# EAGLE schematic ServoIface_v1.0 (EAGLE 6.4)
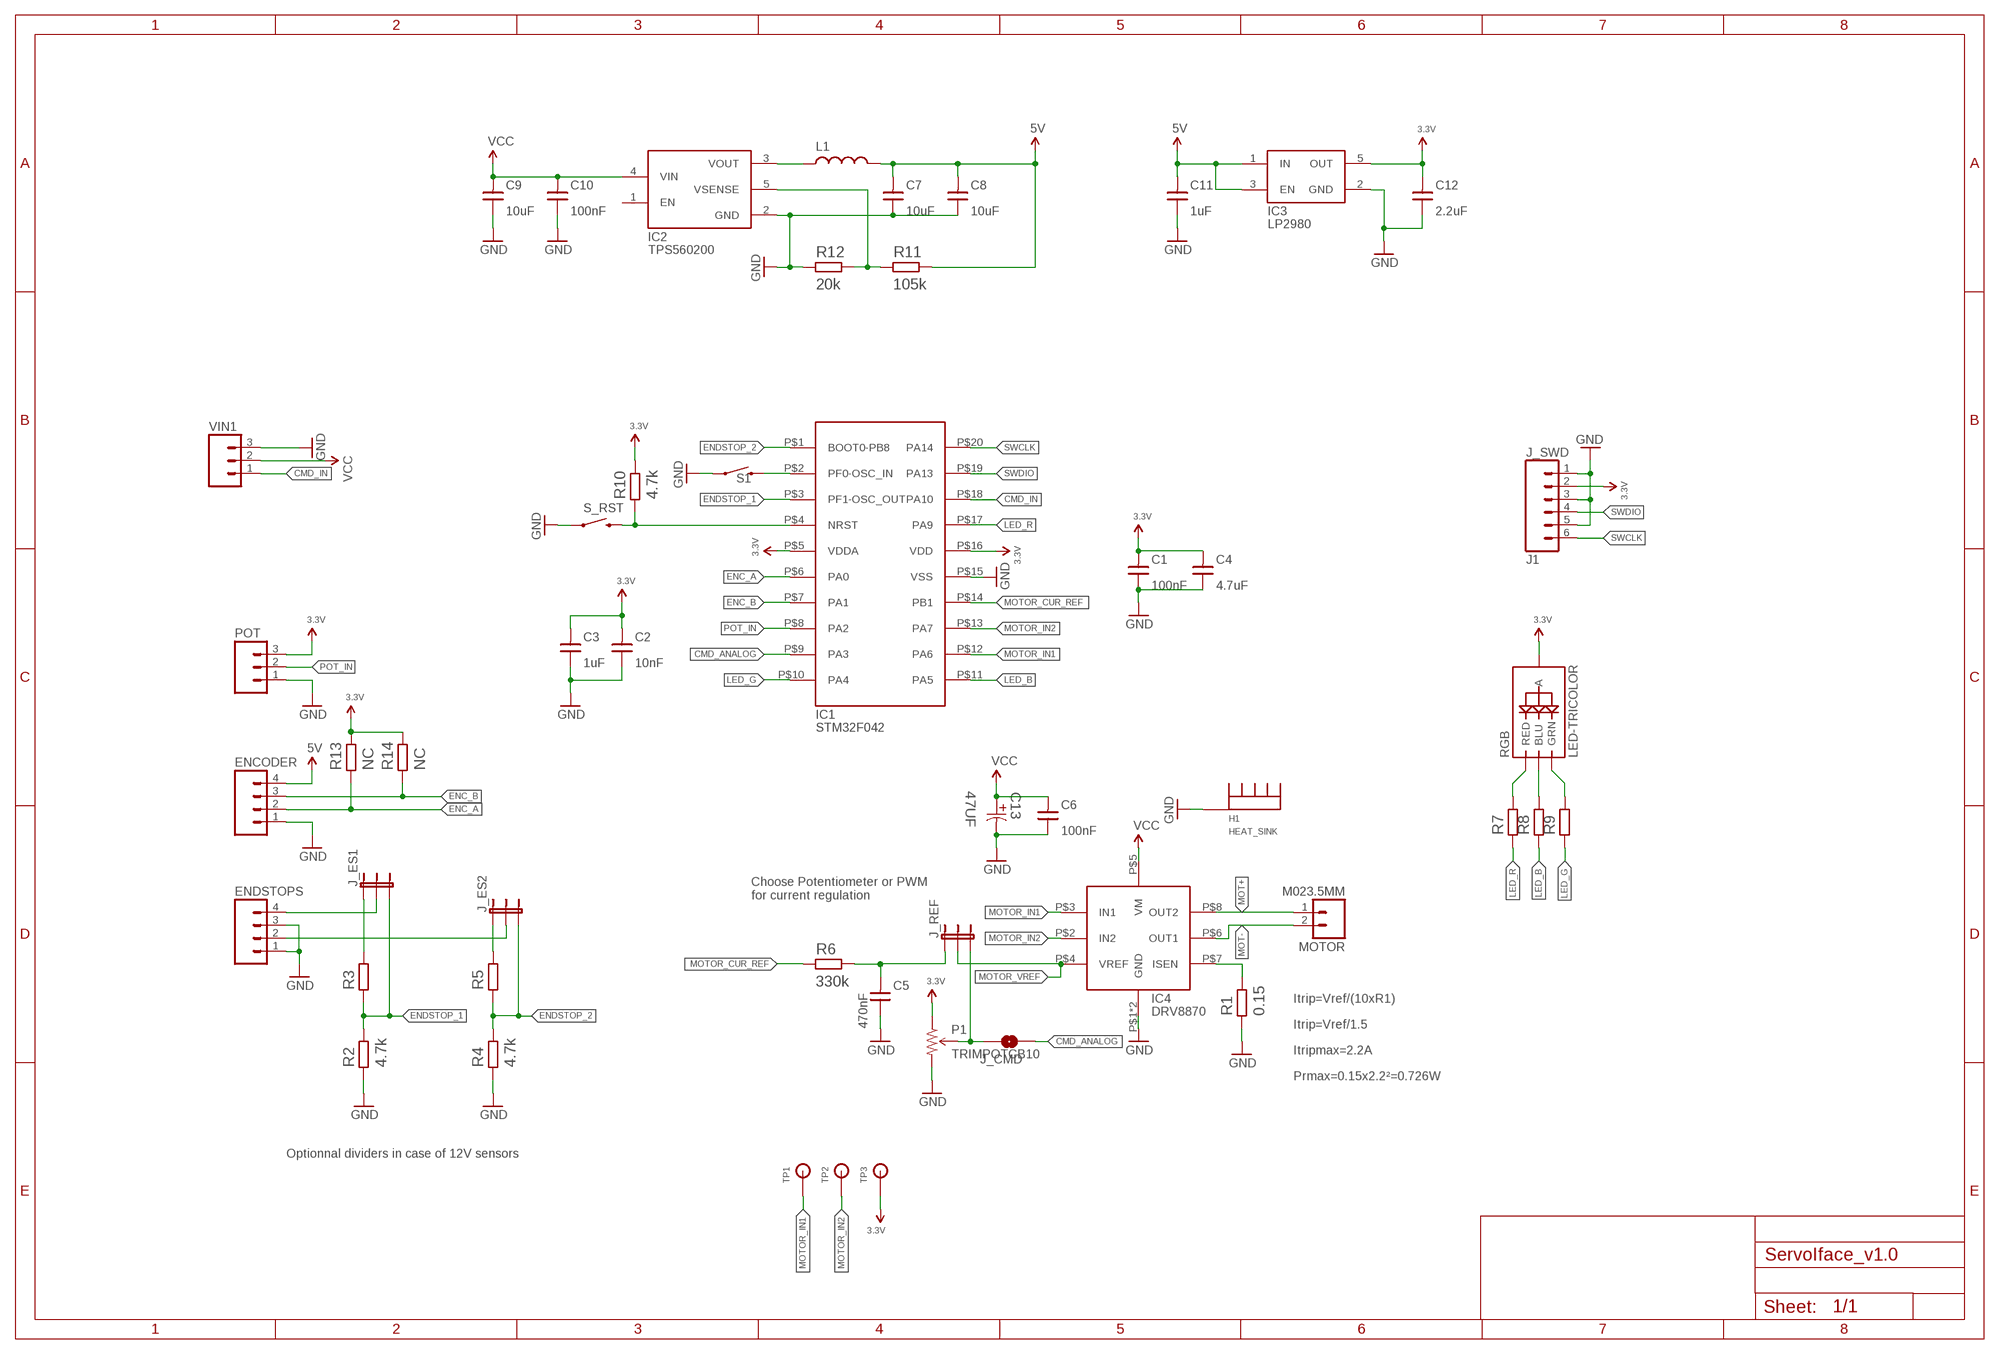
[diagram p0: schematic, sheet 1]

## Parts
C1  100nF  C0603  [R0603]
C2  10nF  C0603  [R0603]
C3  1uF  C0805  [R0805]
C4  4.7uF  C0805  [R0805]
C5  470nF  C0603  [R0603]
C6  100nF  C0603  [R0603]
C7  10uF  C0805  [R0805]
C8  10uF  C0805  [R0805]
C9  10uF  C1206  [1206]
C10  100nF  C0603  [R0603]
C11  1uF  C0805  [R0805]
C12  2.2uF  C0805  [R0805]
C13  47UF  C_PANAFM1E470-P2.0  [CAPPR200-500X1600]
ENCODER  M04SCREW  [SCREWTERMINAL-3.5MM-4]
ENDSTOPS  M04SCREW  [SCREWTERMINAL-3.5MM-4]
H1  HEAT_SINK  [HEAT_A5_SA]
IC1  STM32F042  [TSSOP20]
IC2  TPS560200  [SOT23-5L]
IC3  LP2980  [SOT23-5L]
IC4  DRV8870  [HSOP_8P]
J1  J_SWD  ZIF-06-1MM  [ZIF-06-1MM]
J_CMD  JUMPER-PAD-2-NO  [PAD-JUMPER-2-NO_NO_SILK]
J_ES1  JUMPER-3SMD  [SJ_3]
J_ES2  JUMPER-3SMD  [SJ_3]
J_REF  JUMPER-3SMD  [SJ_3]
L1  LNRG_4026  [NRG_4026]
MOTOR  M023.5MM  [SCREWTERMINAL-3.5MM-2]
P1  TRIMPOTCB10  [POT_CB10]
POT  M03SCREW  [SCREWTERMINAL-3.5MM-3]
R1  0.15  R2512  [CRF2512]
R2  4.7k  R0603  [R0603]
R3  R0603  [R0603]
R4  4.7k  R0603  [R0603]
R5  R0603  [R0603]
R6  330k  R0603  [R0603]
R7  R0603  [R0603]
R8  R0603  [R0603]
R9  R0603  [R0603]
R10  4.7k  R0603  [R0603]
R11  105k  R0603  [R0603]
R12  20k  R0603  [R0603]
R13  NC  R0603  [R0603]
R14  NC  R0603  [R0603]
RGB  LED-TRICOLOR  [PLCC4]
S1  SWITCH-MOMENTARY-2SMD-3  [TACTILE_SWITCH_SMD-3]
S_RST  SWITCH-MOMENTARY-2SMD-3  [TACTILE_SWITCH_SMD-3]
TP1  TEST_POINT_R04  [TP_R04]
TP2  TEST_POINT_R04  [TP_R04]
TP3  TEST_POINT_R04  [TP_R04]
VIN1  M03SCREW  [SCREWTERMINAL-3.5MM-3]

## Nets
3.3V: C1.2 C2.2 C3.2 C4.2 C12.2 IC1.P$5(VDDA) IC1.P$16(VDD) IC3.5(OUT) J1.2 P1.P$1(CCW) POT.3 R10.2 R13.2 R14.2 RGB.P$1(A) TP3.P$1
5V: C7.2 C8.2 C11.2 ENCODER.4 IC3.1(IN) IC3.3(EN) L1.P$2 R11.2
CMD_ANALOG: IC1.P$9(PA3) J_CMD.1
CMD_IN: IC1.P$18(PA10) VIN1.1
ENC_A: ENCODER.2 IC1.P$6(PA0) R13.1
ENC_B: ENCODER.3 IC1.P$7(PA1) R14.1
ENDSTOP_1: IC1.P$3(PF1-OSC_OUT) J_ES1.3 R2.2 R3.1
ENDSTOP_2: IC1.P$1(BOOT0-PB8) J_ES2.3 R4.2 R5.1
GND: C1.1 C2.1 C3.1 C4.1 C5.1 C6.1 C7.1 C8.1 C9.1 C10.1 C11.1 C12.1 C13.2 ENCODER.1 ENDSTOPS.1 ENDSTOPS.3 H1.P$1 IC1.P$15(VSS) IC2.2(GND) IC3.2(GND) IC4.P$1(GND) IC4.PAD(GND) J1.1 J1.3 J1.5 P1.P$2(CW) POT.1 R1.P$1 R2.1 R4.1 R12.1 S1.1 S_RST.1 VIN1.3
LED_B: IC1.P$11(PA5) R8.1
LED_G: IC1.P$10(PA4) R9.1
LED_R: IC1.P$17(PA9) R7.1
MOT+: IC4.P$8(OUT2) MOTOR.1
MOT-: IC4.P$6(OUT1) MOTOR.2
MOTOR_CUR_REF: IC1.P$14(PB1) R6.1
MOTOR_IN1: IC1.P$12(PA6) IC4.P$3(IN1) TP1.P$1
MOTOR_IN2: IC1.P$13(PA7) IC4.P$2(IN2) TP2.P$1
MOTOR_VREF: IC4.P$4(VREF) J_REF.2
N$1: IC4.P$7(ISEN) R1.P$2
N$2: ENDSTOPS.2 J_ES2.2
N$3: J_ES2.1 R5.2
N$5: ENDSTOPS.4 J_ES1.2
N$6: J_ES1.1 R3.2
N$7: J_CMD.2 J_REF.3 P1.P$3(WIPER)
N$8: C5.2 J_REF.1 R6.2
N$9: R7.2 RGB.P$4(RED)
N$10: R8.2 RGB.P$2(BLU)
N$11: R9.2 RGB.P$3(GRN)
N$18: IC1.P$4(NRST) R10.1 S_RST.4
N$27: IC2.3(VOUT) L1.P$1
N$29: IC2.5(VSENSE) R11.1 R12.2
POT_IN: IC1.P$8(PA2) POT.2
SW1: IC1.P$2(PF0-OSC_IN) S1.4
SWCLK: IC1.P$20(PA14) J1.6
SWDIO: IC1.P$19(PA13) J1.4
VCC: C6.2 C9.2 C10.2 C13.1 IC2.4(VIN) IC4.P$5(VM) VIN1.2
Unconnected: IC2.1(EN)

## Notes on the sheet
- Choose Potentiometer or PWM
  for current regulation
- Itrip=Vref/(10xR1)
- Itrip=Vref/1.5
- Itripmax=2.2A
- Prmax=0.15x2.2²=0.726W
- Optionnal dividers in case of 12V sensors

## Library data of the parts
C1-C12 = 0SBLib:C
C13 = 0SBLib:C_PANA: Aluminum Electrolytic Capacitors; MPN: EEUFM1E470; OC_FARNELL: 1848386; OC_NEWARK: 17T5134; RATEDVOLTAGE: 25V; SUPPLIER: PANASONIC; TOLERANCE: ±20 %
ENCODER ENDSTOPS = 0SBLib:M04: Header 4 Standard 4-pin 0.1" header. Use with straight break away headers (SKU : PRT-00116), right angle break away headers (PRT-00553), swiss pins (PRT-00743), machine pins (PRT-00117), and female headers (PRT-00115). Molex polarized connector foot print use with SKU : PRT-08231 with associated crimp pins and housings. 1MM SMD Version SKU: PRT-10208
H1 = 0SBLib:HEAT_SINK: ICK SMD A 5 SA Farnell 4302163
IC1 = 0SBLib:STM32F042: ARM®-based 32-bit MCU, up to 32 KB Flash, crystal-less USB FS 2.0, CAN, 8 timers, ADC & comm. interfaces, 2.0 - 3.6 V
IC2 = 0SBLib:TPS560200
IC3 = 0SBLib:LP2980
IC4 = 0SBLib:DRV8870: DRV8870 3.6-A Brushed DC Motor Driver (PWM Control)
J1 = 0SBLib:ZIF-06-1MM
J_CMD = SparkFun-Passives:JUMPER-PAD-2-NO
J_ES1 J_ES2 J_REF = 0SBLib:JUMPER-3
L1 = 0SBLib:L
MOTOR = SparkFun-Connectors:M02: Standard 2-pin 0.1" header. Use with - straight break away headers ( PRT-00116) - right angle break away headers (PRT-00553) - swiss pins (PRT-00743) - machine pins (PRT-00117) - female headers (PRT-00115) Molex polarized connector foot print use with: PRT-08233 with associated crimp pins and housings. 2.54_SCREWTERM for use with PRT-10571. 3.5mm Screw Terminal footprints for PRT-08084 5mm Screw Terminal footprints for use with PRT-08432
P1 = 0SBLib:TRIMPOT: Various small potentiometers for "set-and-forget" applications
POT VIN1 = 0SBLib:M03: Header 3 Standard 3-pin 0.1" header. Use with straight break away headers (SKU : PRT-00116), right angle break away headers (PRT-00553), swiss pins (PRT-00743), machine pins (PRT-00117), and female headers (PRT-00115). Molex polarized connector foot print use with SKU : PRT-08232 with associated crimp pins and housings.
R1-R14 = 0SBLib:R
RGB = 0SBLib:LED-TRICOLOR: Tri-Color LED SMD Proven layout and schematic for triple color LED in SMD package - common anode. Spark Fun Electronics SKU : COM-07844
S1 S_RST = SparkFun-Electromechanical:SWITCH-MOMENTARY-2: Various NO switches- pushbuttons, reed, etc
TP1-TP3 = 0SBLib:TEST_POINT